# Altium project PCB四轴.PrjPCB
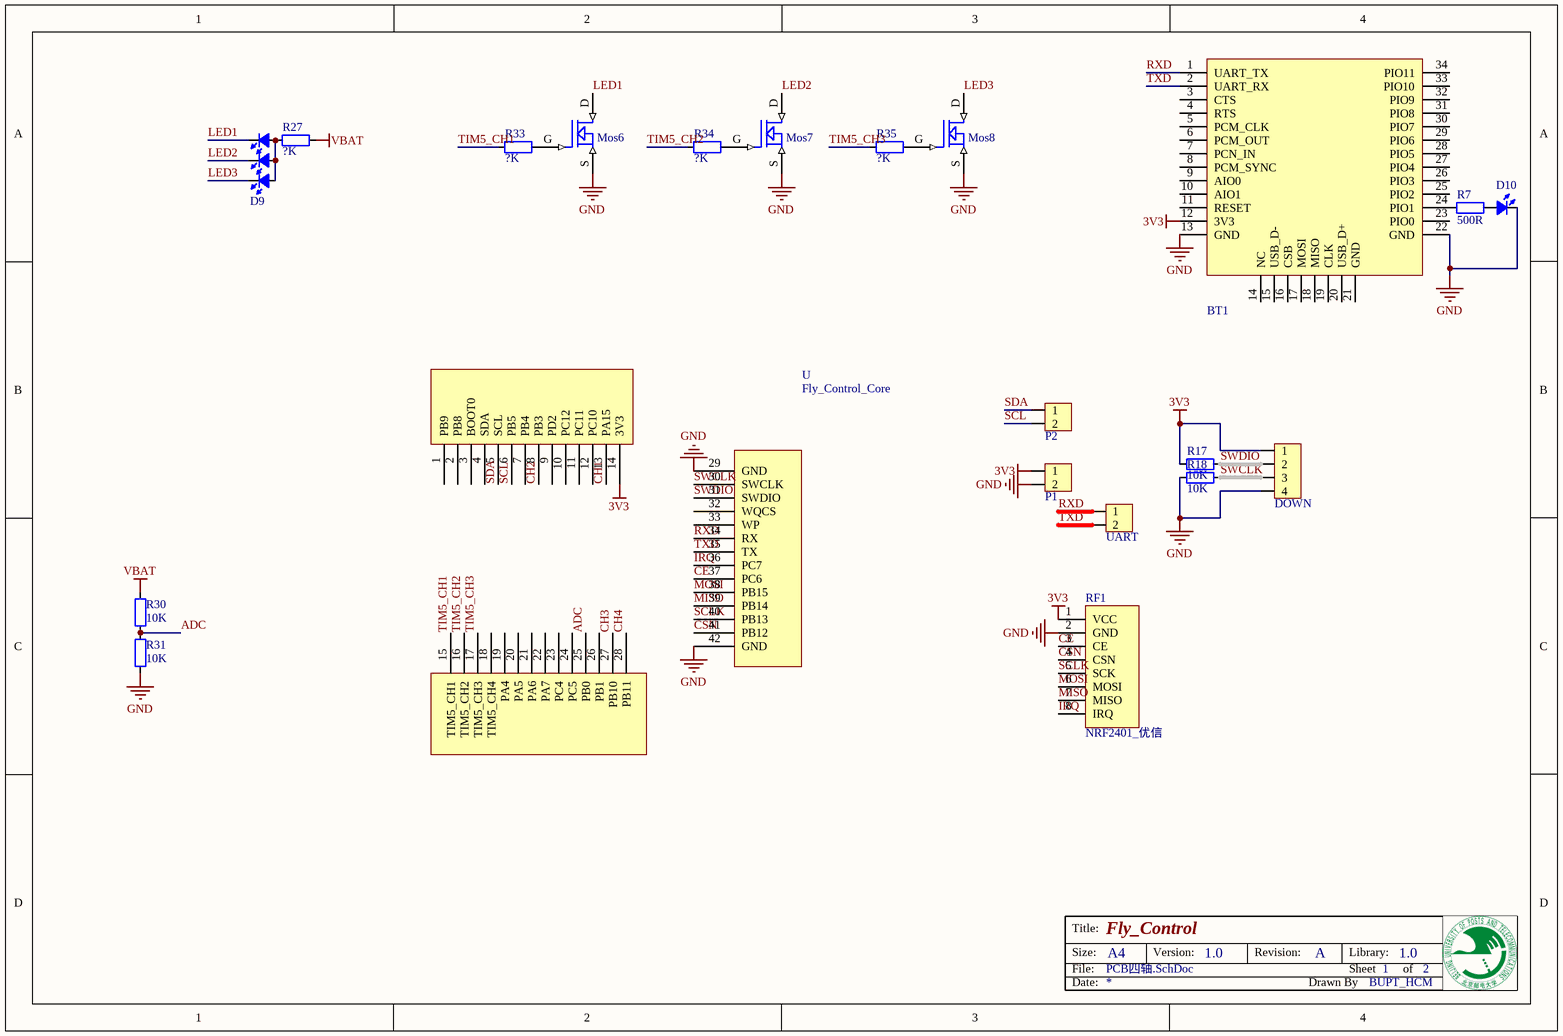
[diagram p0: PCB四轴.SchDoc]
2 sheets, 60 parts. Net scope: global (net labels, ports and power ports of the same name join across sheets).
Board file: PCB四轴.PcbDoc
Sheets:
  PCB四轴.SchDoc
  PCB四轴接口.SchDoc

## Sheet PCB四轴.SchDoc: Fly_Control
size A4; CompanyName: BUPT; DrawnBy: BUPT_HCM; Organization: BUPT_Robot; Revision: A; SheetNumber: 1; SheetTotal: 2; Version: 1.0; LibVersion: 1.0

### Parts
BT1  Bluetooth_HC05  [Bluetooth_HC05]  (value not drawn)
D9  LED_5050_RGB  [LED_5050_6P]  (value not drawn)
D10  LED_0805  [LED_0805_BLUE]  (value not drawn)
DOWN  HDR1x4_2.54  [HDR1X4_2.54_90]  (value not drawn)
Mos6  MOSFET N  [Nmos_SOT23]  (value not drawn)
Mos7  MOSFET N  [Nmos_SOT23]  (value not drawn)
Mos8  MOSFET N  [Nmos_SOT23]  (value not drawn)
P1  HDR1x2_2.54  [HDR1X2_2.54_180]  (value not drawn)
P2  HDR1x2_2.54  [HDR1X2_2.54_180]  (value not drawn)
R7  value 500R  [RES_0603]  (hidden comment: Res_0603)
R17  value 10K  [RES_0603]  (hidden comment: Res_0603)
R18  value 10K  [RES_0603]  (hidden comment: Res_0603)
R27  value ?K  [RES_0603]  (hidden comment: Res_0603)
R30  value 10K  [RES_0603]  (hidden comment: Res_0603)
R31  value 10K  [RES_0603]  (hidden comment: Res_0603)
R33  value ?K  [RES_0603]  (hidden comment: Res_0603)
R34  value ?K  [RES_0603]  (hidden comment: Res_0603)
R35  value ?K  [RES_0603]  (hidden comment: Res_0603)
RF1  NRF2401_优信  [nrf24l01_youxin]
U  Fly_Control_Core  [Fly_Control_Core]
UART  HDR1x2_2.54  [HDR1X2_2.54_180]  (value not drawn)

### Nets
3V3: BT1.12(3V3) DOWN.1 P1.1 R17.2 RF1.1(VCC) U.14(3V3)
GND: BT1.13(GND) BT1.22(GND) D10.2(K) DOWN.4 Mos6.S Mos7.S Mos8.S P1.2 R18.2 R31.1 RF1.2(GND) U.29(GND) U.42(GND)
VBAT: R27.1 R30.2
ADC: R30.1 R31.2 U.25(PB0)
CE: RF1.3(CE) U.37(PC6)
CH1: U.13(PA15)
CH2: U.8(PB3)
CH3: U.27(PB10)
CH4: U.28(PB11)
CSN: RF1.4(CSN) U.41(PB12)
IRQ: RF1.8(IRQ) U.36(PC7)
LED1: D9.3(K) Mos6.D
LED2: D9.2(K) Mos7.D
LED3: D9.1(K) Mos8.D
MISO: RF1.7(MISO) U.39(PB14)
MOSI: RF1.6(MOSI) U.38(PB15)
RXD: BT1.1(UART_TX) U.34(RX) UART.1
SCL: P2.2 U.6(PB5)
SCLK: RF1.5(SCK) U.40(PB13)
SDA: P2.1 U.5(SCL)
SWCLK: DOWN.3 R18.1 U.30(SWCLK)
SWDIO: DOWN.2 R17.1 U.31(SWDIO)
TIM5_CH1: R33.1 U.15(TIM5_CH1)
TIM5_CH2: R34.1 U.16(TIM5_CH2)
TIM5_CH3: R35.1 U.17(TIM5_CH3)
TXD: BT1.2(UART_RX) U.35(TX) UART.2
NetBT1_24: BT1.24(PIO1) R7.1
NetD9_4: D9.4(A) D9.5(A) D9.6(A) R27.2
NetD10_1: D10.1(A) R7.2
NetMos6_G: Mos6.G R33.2
NetMos7_G: Mos7.G R34.2
NetMos8_G: Mos8.G R35.2

Not connected (* = marked no-connect by the designer): BT1 3(CTS) 4(RTS) 5(PCM_CLK) 6(PCM_OUT) 7(PCN_IN) 8(PCM_SYNC) 9(AIO0) 10(AIO1) 11(RESET) 14(NC) 15(USB_D-) 16(CSB) 17(MOSI) 18(MISO) 19(CLK) 20(USB_D+) 21(GND) 23(PIO0) 25(PIO2) 26(PIO3) 27(PIO4) 28(PIO5) 29(PIO6) 30(PIO7) 31(PIO8) 32(PIO9) 33(PIO10) 34(PIO11); U 1(PB9) 2(PB8) 3(BOOT0) 4(SDA) 7(PB4) 9(PD2) 10(PC12) 11(PC11) 12(PC10) 18(TIM5_CH4) 19(PA4) 20(PA5) 21(PA6) 22(PA7) 23(PC4) 24(PC5) 26(PB1) 32(WQCS) 33(WP)

### Notes on the sheet
- Title:
- Size:
- Date:
- File:
- A4
- Version:
- Revision:
- Drawn By
- Sheet
- Library:
- of

### Library data of the parts
BT1 = Bluetooth_HC05: Module
D9 = LED_5050_RGB: LED
D10 = LED_0805: LED
DOWN = HDR1x4_2.54: Header
Mos6-Mos8 = MOSFET N: MOS SOT23
P1 P2 UART = HDR1x2_2.54: Header
R7 R17 R18 R27 R30 R31 R33-R35 = Res_0603: Resistor

## Sheet PCB四轴接口.SchDoc: Template
size A4; CompanyName: BUPT; DrawnBy: BUPT_HCM; Organization: BUPT_Robot; Revision: A; SheetNumber: 1; SheetTotal: 1; Version: 0.0; LibVersion: 0.0
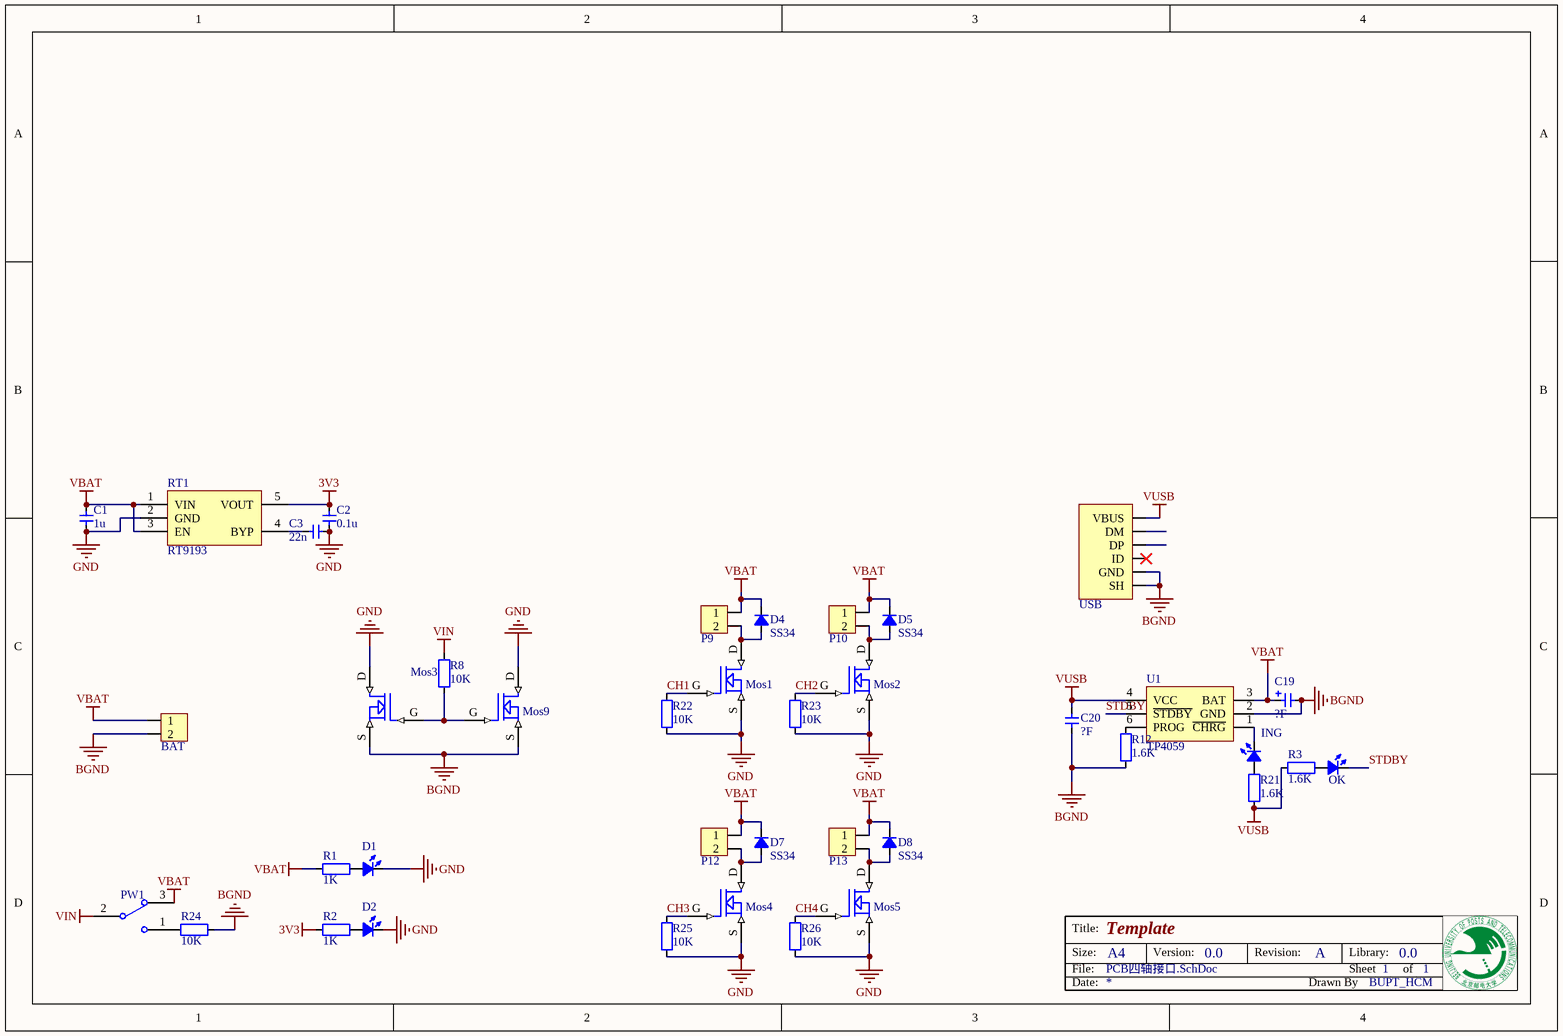
[diagram p1: PCB四轴接口.SchDoc]

### Parts
BAT  HDR1x2_2.54  [HDR1X2_2.54_90]  (value not drawn)
C1  value 1u  [CAP_0603]  (hidden comment: Cap_0603)
C2  value 0.1u  [CAP_0603]  (hidden comment: Cap_0603)
C3  value 22n  [CAP_0603]  (hidden comment: Cap_0603)
C19  value ?F  [CAP_TAN_D2917]  (hidden comment: Cap_Tan_2917)
C20  value ?F  [CAP_0805]  (hidden comment: Cap_0805)
D1  LED_0805  [LED_0805_YELLOW]  (value not drawn)
D2  LED_0805  [LED_0805_YELLOW]  (value not drawn)
D4  value SS34  [DO-214AC]  (hidden comment: Diode_SMA)
D5  value SS34  [DO-214AC]  (hidden comment: Diode_SMA)
D7  value SS34  [DO-214AC]  (hidden comment: Diode_SMA)
D8  value SS34  [DO-214AC]  (hidden comment: Diode_SMA)
ING  LED_0805  [LED_0805_RED]  (value not drawn)
Mos1  MOSFET N  [Nmos_SOT23]  (value not drawn)
Mos2  MOSFET N  [Nmos_SOT23]  (value not drawn)
Mos3  MOSFET N  [Nmos_SOT23]  (value not drawn)
Mos4  MOSFET N  [Nmos_SOT23]  (value not drawn)
Mos5  MOSFET N  [Nmos_SOT23]  (value not drawn)
Mos9  MOSFET N  [Nmos_SOT23]  (value not drawn)
OK  LED_0805  [LED_0805_GREEN]  (value not drawn)
P9  HDR1x2_2.54  [HDR1X2_2.54_180]  (value not drawn)
P10  HDR1x2_2.54  [HDR1X2_2.54_180]  (value not drawn)
P12  HDR1x2_2.54  [HDR1X2_2.54_180]  (value not drawn)
P13  HDR1x2_2.54  [HDR1X2_2.54_180]  (value not drawn)
PW1  SwitchSPDT_2.8x6.6_90  [SwitchSPDT_2.8X6.6_90]  (value not drawn)
R1  value 1K  [RES_0603]  (hidden comment: Res_0603)
R2  value 1K  [RES_0603]  (hidden comment: Res_0603)
R3  value 1.6K  [RES_0603]  (hidden comment: Res_0603)
R8  value 10K  [RES_0603]  (hidden comment: Res_0603)
R12  value 1.6K  [RES_0603]  (hidden comment: Res_0603)
R21  value 1.6K  [RES_0603]  (hidden comment: Res_0603)
R22  value 10K  [RES_0603]  (hidden comment: Res_0603)
R23  value 10K  [RES_0603]  (hidden comment: Res_0603)
R24  value 10K  [RES_0603]  (hidden comment: Res_0603)
R25  value 10K  [RES_0603]  (hidden comment: Res_0603)
R26  value 10K  [RES_0603]  (hidden comment: Res_0603)
RT1  RT9193  [SOT23-5]
U1  TP4059  [SOT23-6]
USB  USB_Micro  [USB_Micro-AB]  (value not drawn)

### Nets
3V3: C2.2 R2.1 RT1.5(VOUT)
BGND: BAT.2 C19.2 C20.1 Mos3.S Mos9.S R12.2 R24.2 U1.2(GND) USB.0(SH) USB.5(GND)
GND: C1.1 C2.1 C3.1 D1.2(K) D2.2(K) Mos1.S Mos2.S Mos3.D Mos4.S Mos5.S Mos9.D R22.1 R23.1 R25.1 R26.1 RT1.2(GND)
VBAT: BAT.1 C1.2 C19.1 D4.2(K) D5.2(K) D7.2(K) D8.2(K) P9.1 P10.1 P12.1 P13.1 PW1.3 R1.1 RT1.1(VIN) RT1.3(EN) U1.3(BAT)
VIN: PW1.2 R8.2
VUSB: C20.2 R3.1 R21.2 U1.4(VCC) USB.1(VBUS)
CH1: Mos1.G R22.2
CH2: Mos2.G R23.2
CH3: Mos4.G R25.2
CH4: Mos5.G R26.2
STDBY: OK.2(K) U1.5(~{STDBY})
NetC3_2: C3.2 RT1.4(BYP)
NetD1_1: D1.1(A) R1.2
NetD2_1: D2.1(A) R2.2
NetD4_1: D4.1(A) Mos1.D P9.2
NetD5_1: D5.1(A) Mos2.D P10.2
NetD7_1: D7.1(A) Mos4.D P12.2
NetD8_1: D8.1(A) Mos5.D P13.2
NetING_1: ING.1(A) R21.1
NetING_2: ING.2(K) U1.1(~{CHRG})
NetMos3_G: Mos3.G Mos9.G R8.1
NetOK_1: OK.1(A) R3.2
NetPW1_1: PW1.1 R24.1
NetR12_1: R12.1 U1.6(PROG)

Not connected (* = marked no-connect by the designer): USB 2(DM) 3(DP) 4(ID)*

### Notes on the sheet
- Title:
- Size:
- Date:
- File:
- A4
- Version:
- Revision:
- Drawn By
- Sheet
- Library:
- of

### Library data of the parts
BAT = HDR1x2_2.54: Header
C1-C3 = Cap_0603: Capacitor
C19 = Cap_Tan_2917: Capacitor
C20 = Cap_0805: Capacitor
D1 D2 ING OK = LED_0805: LED
D4 D5 D7 D8 = Diode_SMA: Diode
Mos1-Mos5 Mos9 = MOSFET N: MOS SOT23
P9 P10 P12 P13 = HDR1x2_2.54T: Header
PW1 = SwitchSPDT_2.8x6.6_90: Switch
R1-R3 R8 R12 R21-R26 = Res_0603: Resistor
RT1 = RT9193: Power
USB = USB_Micro: USB

## Nets that join several sheets
3V3: PCB四轴 (6 pins), PCB四轴接口 (C2.2 R2.1 RT1.5)
GND: PCB四轴 (13 pins), PCB四轴接口 (16 pins)
VBAT: PCB四轴 (R27.1 R30.2), PCB四轴接口 (16 pins)
CH1: PCB四轴 (U.13), PCB四轴接口 (Mos1.G R22.2)
CH2: PCB四轴 (U.8), PCB四轴接口 (Mos2.G R23.2)
CH3: PCB四轴 (U.27), PCB四轴接口 (Mos4.G R25.2)
CH4: PCB四轴 (U.28), PCB四轴接口 (Mos5.G R26.2)